# Altium schematic sheet nusense-fans.schdoc: NUSense
size A4; Organization: Elby Designs; Address1: 9 Follan Close; Address2: Kariong; Address3: NSW 2250; Address4: Australia; Revision: 1; SheetNumber: 4; SheetTotal: 9; DrawnBy: Fan Controller; Engineer: Laurie Biddulph; PageSetup: Record=PageOptions|CenterHorizontal=True|CenterVertical=True|PrintScale=1.38|XCorrection=1.00|YCorrection=1.00|PrintKind=1|BorderSize=5000000|LeftOffset=0|BottomOffset=0|Orientation=2|PaperLength=1000|PaperWidth=1000|Scale=100|PaperSource=7|PrintQuality=-4|MediaType=1|DitherType=10|PaperKind=A3|PrintScaleMode=1
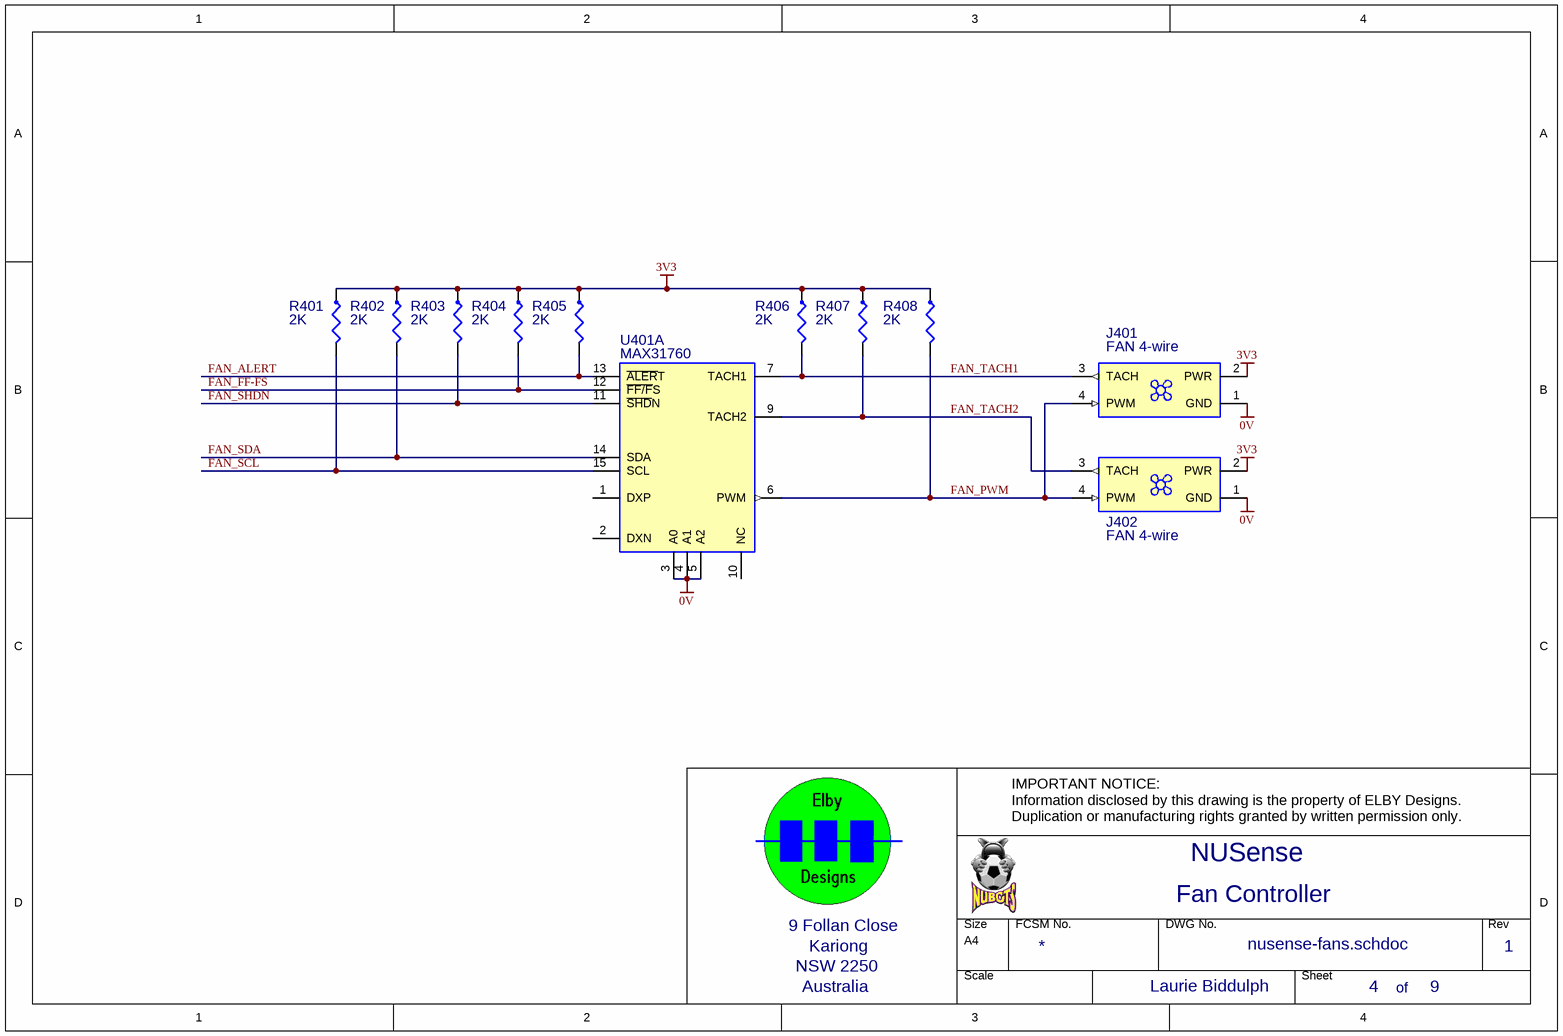
[diagram p0: nusense-fans.schdoc]

## Parts
J401  FAN 4-wire
J402  FAN 4-wire
R401  2K  [AXIAL-0.4(LB)]
R402  2K  [AXIAL-0.4(LB)]
R403  2K  [AXIAL-0.4(LB)]
R404  2K  [AXIAL-0.4(LB)]
R405  2K  [AXIAL-0.4(LB)]
R406  2K  [AXIAL-0.4(LB)]
R407  2K  [AXIAL-0.4(LB)]
R408  2K  [AXIAL-0.4(LB)]
U401  MAX31760  (part A of 2)

## Nets
0V: J401.1(GND) J402.1(GND) U401.3(A0) U401.4(A1) U401.5(A2)
3V3: J401.2(PWR) J402.2(PWR) R401.1 R402.1 R403.1 R404.1 R405.1 R406.1 R407.1 R408.1
FAN_ALERT: R405.2 U401.13(~{ALER}T)
FAN_FF-FS: R404.2 U401.12(~{FF/F}S)
FAN_PWM: J401.4(PWM) J402.4(PWM) R408.2 U401.6(PWM)
FAN_SCL: R401.2 U401.15(SCL)
FAN_SDA: R402.2 U401.14(SDA)
FAN_SHDN: R403.2 U401.11(~{SHD}N)
FAN_TACH1: J401.3(TACH) R406.2 U401.7(TACH1)
FAN_TACH2: J402.3(TACH) R407.2 U401.9(TACH2)

Not connected (* = marked no-connect by the designer): U401 1(DXP) 2(DXN) 10(NC)

## Notes on the sheet
- IMPORTANT NOTICE:
  Information disclosed by this drawing is the property of ELBY Designs.
  Duplication or manufacturing rights granted by written permission only.
- of

## Library data of the parts
J401 J402 = FAN-4wire: 4-Wire Fan
R401-R408 = RM-2K(LB): 0.5W 1% Metal Film Resistor; EMRP: RM-2K
U401 = MAX31760: Precision Fan Speed